# EAGLE design modulator (EAGLE 8.0.2)
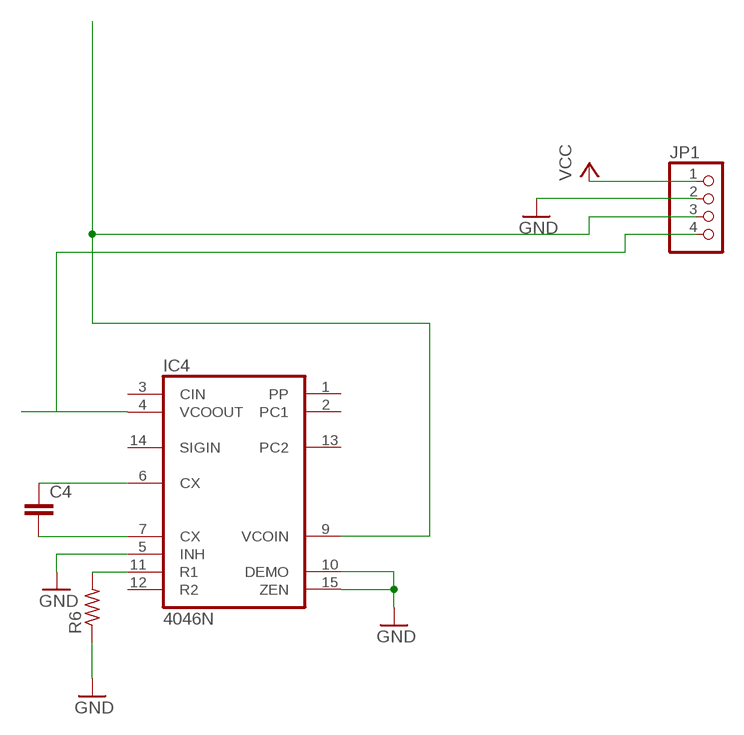
[diagram p0: schematic, sheet 1]

## Parts
C4  C2.5/2  [C2.5-2]
IC4  4046N  [DIL16]
JP1  PINHD-1X4  [1X04]
R6  R-US_0204/7  [0204/7]

## Nets
GND: IC4.5(INH) IC4.10(DEMO) IC4.15(ZEN) JP1.2 R6.1
N$15: IC4.9(VCOIN) JP1.3
N$17: C4.1 IC4.6(CX)
N$19: C4.2 IC4.7(CX)
N$20: IC4.11(R1) R6.2
N$21: IC4.4(VCOOUT) JP1.4
VCC: JP1.1
Unconnected: IC4.1(PP) IC4.2(PC1) IC4.3(CIN) IC4.12(R2) IC4.13(PC2) IC4.14(SIGIN)

## Power pins joined to a net without a drawn wire
VDD: IC4.16(VDD)
VSS: IC4.8(VSS)

## Library data of the parts
C4 = capacitor-wima:C: CAPACITOR naming: grid - package width
IC4 = 40xx:4046: Micropower PLL
JP1 = pinhead:PINHD-1X4: PIN HEADER
R6 = adafruit:R-US_: RESISTOR, American symbol

## Board
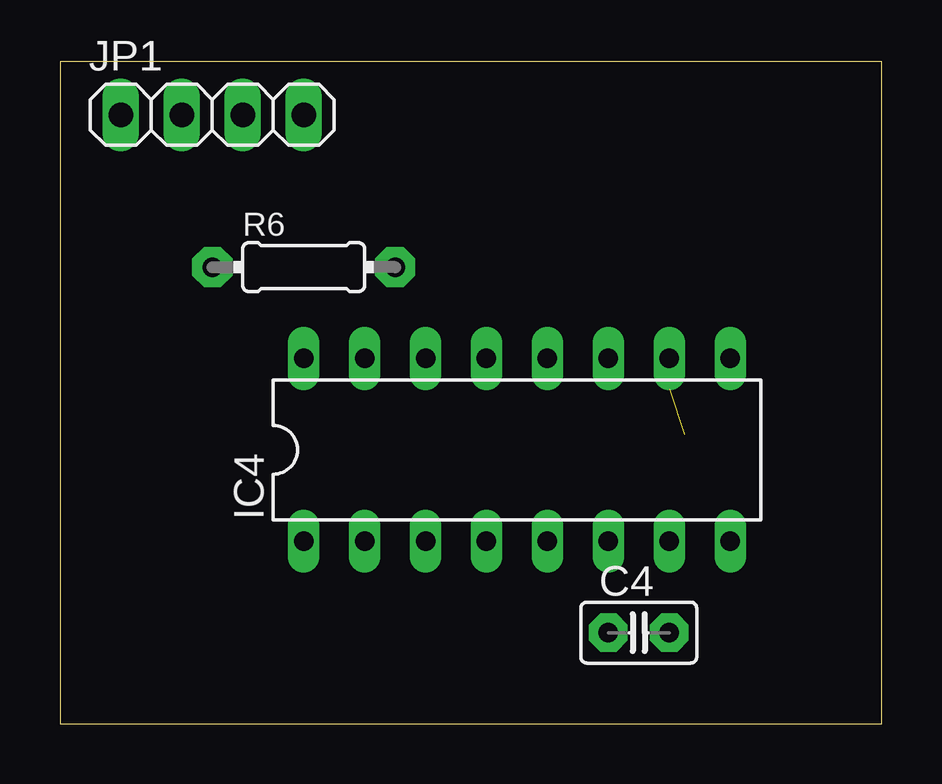
[diagram p1: board, top side]
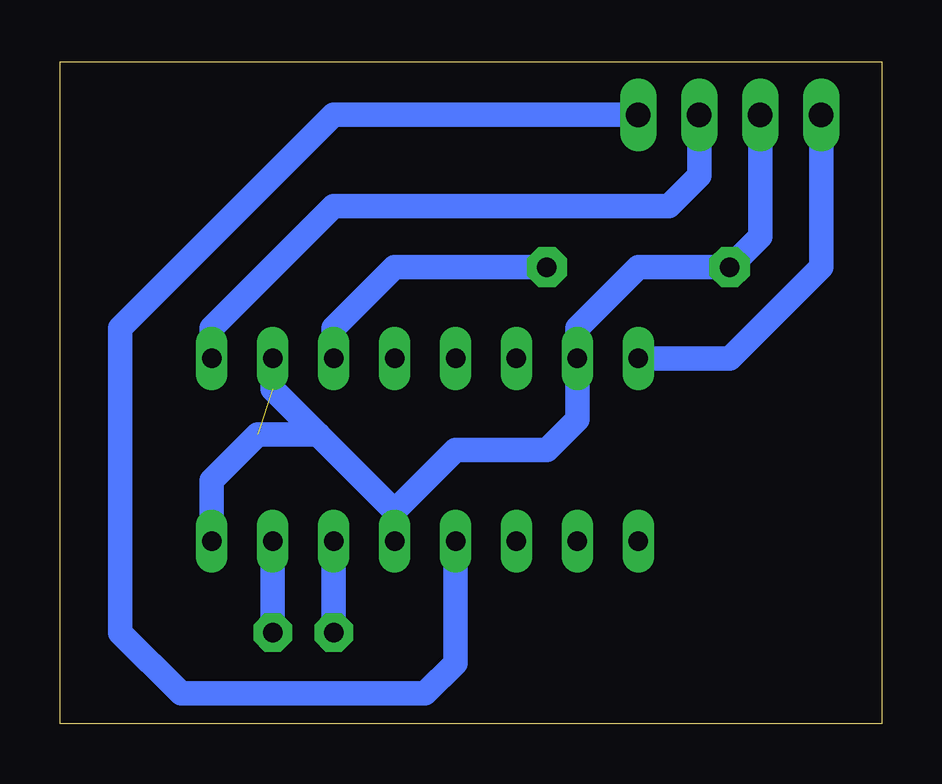
[diagram p2: board, bottom side, seen from below]

Size 34.27 x 27.61 mm. Coordinates in mm from the lower left corner, seen from the top.
Outline: 0,0 34.27,0 34.27,27.61 0,27.61 0,0
Copper layers (1*16): Top 0.035mm / dielectric 1.5mm / Bottom 0.035mm
Design rules "default": minimum track width 10mil, minimum drill 24mil, track to track 8mil, track to pad 8mil, pad to pad 8mil, via to via 8mil, smd to smd 8mil, copper to edge 40mil, drill to drill 8mil, minimum pad ring 10mil, minimum via ring 8mil, stop-mask expansion 4mil, vias tented up to drill 0mil, thermal gap 10mil

### Footprints (pad centres in the part's own frame; a part is rotated, then mirrored left to right if it is on the bottom)
C2.5-2 = drill 0.813 pad 1.6 octagon: 1 -1.27,0; 2 1.27,0
DIL16 = drill 0.813 long: 1 -8.89,-3.81; 2 -6.35,-3.81; 3 -3.81,-3.81; 4 -1.27,-3.81; 5 1.27,-3.81; 6 3.81,-3.81; 7 6.35,-3.81; 8 8.89,-3.81; 9 8.89,3.81; 10 6.35,3.81; 11 3.81,3.81; 12 1.27,3.81; 13 -1.27,3.81; 14 -3.81,3.81; 15 -6.35,3.81; 16 -8.89,3.81
1X04 = drill 1.016 long: 1 -3.81,0; 2 -1.27,0; 3 1.27,0; 4 3.81,0
0204/7 = drill 0.813 pad 1.676 octagon: 1 -3.81,0; 2 3.81,0

### Placement (x,y rotation side)
C4  24.13,3.81 0 top
IC4  19.05,11.43 0 top
JP1  6.35,25.4 0 top
R6  10.16,19.05 0 top

### Tracks (layer width: path | path; a pad name or v marks a point on that pad's centre or on a via)
GND  (1 unrouted)
  Bottom 1.016: IC4.10 25.4,13.97 20.32,8.89 | IC4.5 20.32,8.89 | 20.32,8.89 17.78,11.43 13.97,11.43 12.7,12.7 IC4.15 12.7,16.51 10.16,19.05 R6.1 5.08,20.32 JP1.2 | 23.5,12.06 26.04,12.06 27.94,10.16 27.94,7.62
N$15
  Bottom 1.016: JP1.3 7.62,22.86 8.89,21.59 22.86,21.59 27.94,16.51 IC4.9
N$17
  Bottom 1.016: IC4.6 C4.1
N$19
  Bottom 1.016: IC4.7 C4.2
N$20
  Bottom 1.016: R6.2 20.32,19.05 22.86,16.51 IC4.11
N$21
  Bottom 1.016: JP1.4 22.86,25.4 31.75,16.51 31.75,3.81 29.21,1.27 19.05,1.27 17.78,2.54 IC4.4
VCC
  Bottom 1.016: JP1.1 2.54,19.05 6.35,15.24 10.16,15.24